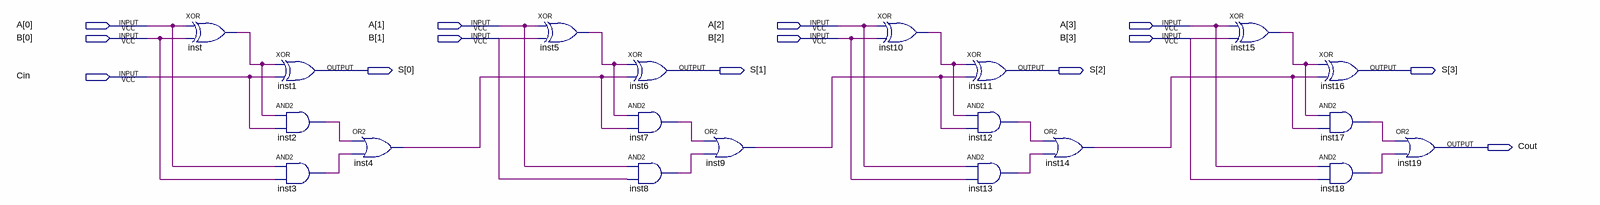
[diagram p0: schematic sheet]
// Quartus schematic ADD4.bdf as structural Verilog: 20 symbols, 14 pins
module ADD4 (
  input  [3:0] A,
  input  [3:0] B,
  input  Cin,
  output [3:0] S,
  output Cout
);

  wire inst2_out, inst3_out, inst4_out, inst5_out, inst7_out, inst8_out, inst9_out, inst10_out, inst12_out,
       inst13_out, inst14_out, inst15_out, inst17_out, inst18_out, inst_out;

  xor inst (inst_out, A[0], B[0]);
  xor inst1 (S[0], inst_out, Cin);
  and inst2 (inst2_out, inst_out, Cin);
  and inst3 (inst3_out, A[0], B[0]);
  or inst4 (inst4_out, inst2_out, inst3_out);
  xor inst5 (inst5_out, A[1], B[1]);
  xor inst6 (S[1], inst5_out, inst4_out);
  and inst7 (inst7_out, inst5_out, inst4_out);
  and inst8 (inst8_out, A[1], B[1]);
  or inst9 (inst9_out, inst7_out, inst8_out);
  xor inst10 (inst10_out, A[2], B[2]);
  xor inst11 (S[2], inst10_out, inst9_out);
  and inst12 (inst12_out, inst10_out, inst9_out);
  and inst13 (inst13_out, A[2], B[2]);
  or inst14 (inst14_out, inst12_out, inst13_out);
  xor inst15 (inst15_out, A[3], B[3]);
  xor inst16 (S[3], inst15_out, inst14_out);
  and inst17 (inst17_out, inst15_out, inst14_out);
  and inst18 (inst18_out, A[3], B[3]);
  or inst19 (Cout, inst17_out, inst18_out);
endmodule
